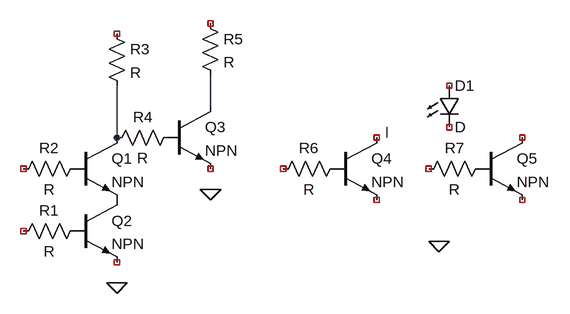
[diagram p0: schematic XOR_NAND.asc]
XOR_NAND.asc, the LTspice schematic file:
Version 4
SHEET 1 880 680
WIRE 320 16 320 -32
WIRE 176 64 176 -16
WIRE 592 64 592 48
FLAG 176 288 0
FLAG 320 144 0
FLAG 672 224 0
SYMBOL npn 112 64 R0
SYMATTR InstName Q1
SYMBOL npn 112 160 R0
SYMATTR InstName Q2
SYMBOL npn 256 16 R0
SYMATTR InstName Q3
SYMBOL npn 512 64 R0
SYMATTR InstName Q4
SYMBOL npn 736 64 R0
SYMATTR InstName Q5
SYMBOL LED 672 -16 R0
SYMATTR InstName D1
SYMBOL res 128 192 R90
WINDOW 0 0 56 VBottom 2
WINDOW 3 32 56 VTop 2
SYMATTR InstName R1
SYMBOL res 128 96 R90
WINDOW 0 0 56 VBottom 2
WINDOW 3 32 56 VTop 2
SYMATTR InstName R2
SYMBOL res 160 -112 R0
SYMATTR InstName R3
SYMBOL res 272 48 R90
WINDOW 0 0 56 VBottom 2
WINDOW 3 32 56 VTop 2
SYMATTR InstName R4
SYMBOL res 304 -128 R0
SYMATTR InstName R5
SYMBOL res 528 96 R90
WINDOW 0 0 56 VBottom 2
WINDOW 3 32 56 VTop 2
SYMATTR InstName R6
SYMBOL res 752 96 R90
WINDOW 0 0 56 VBottom 2
WINDOW 3 32 56 VTop 2
SYMATTR InstName R7

The netlist it stands for:
* XOR_NAND.asc
Q1 N002 P001 P002 0 NPN
Q2 P002 P003 NC_01 0 NPN
Q3 N001 P004 NC_02 0 NPN
Q4 NC_03 P005 NC_04 0 NPN
Q5 NC_05 P006 NC_06 0 NPN
D1 NC_07 NC_08 D
R1 P003 NC_09 R
R2 P001 NC_10 R
R3 NC_11 N002 R
R4 P004 N002 R
R5 NC_12 N001 R
R6 P005 NC_13 R
R7 P006 NC_14 R
.model D D
.lib standard.dio
.model NPN NPN
.model PNP PNP
.lib standard.bjt
.backanno
.end